# Altium schematic sheet SD_Card.SchDoc: SD Card
size 431 x 279 mm; SheetNumber: 11; SheetTotal: 14; SheetRevision: 1.0
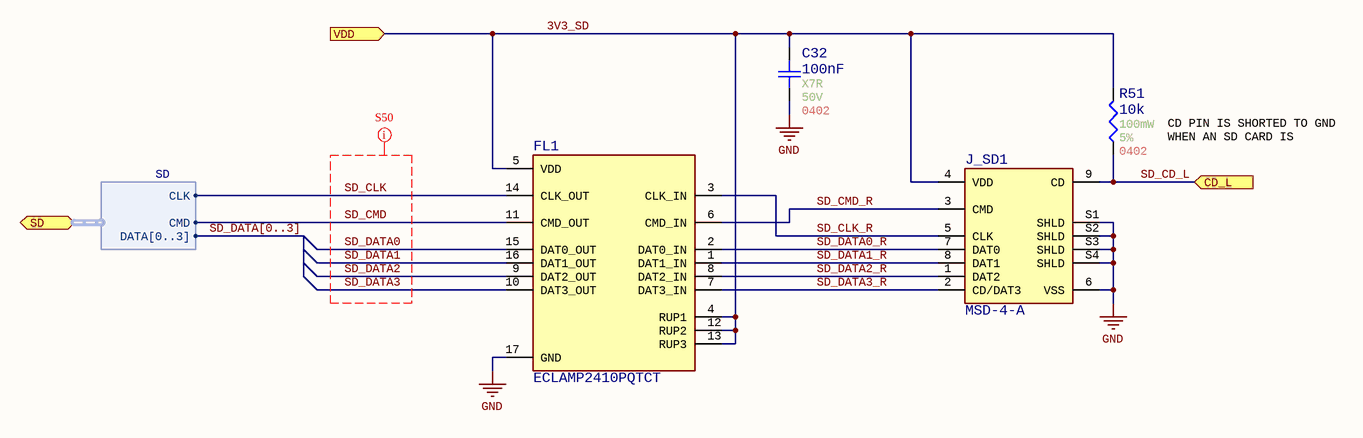
[diagram p0: SD_Card.SchDoc]

## Parts
C32  value 100nF  Temperature Coefficient: X7R  Voltage Rating: 50V  Case/Package: 0402  [Generic 0402 capacitor]  (hidden comment: GRT155R71H104KE01D)
FL1  ECLAMP2410PQTCT  [ECLAMP2410PQTCT]
J_SD1  MSD-4-A  [MSD-4-A]
R51  value 10k  Power: 100mW  Tolerance: 5%  Case/Package: 0402  [Generic 0402 Resistor]  (hidden comment: ERJ-2GEJ103X)

## Ports
CD_L (in), SD (bidir, harness SD), VDD (in)

## Harnesses
SD: DATA[0..3], CLK, CMD

## Nets
GND: C32.1 FL1.17(GND) J_SD1.6(VSS) J_SD1.S1(SHLD) J_SD1.S2(SHLD) J_SD1.S3(SHLD) J_SD1.S4(SHLD)
3V3_SD: C32.2 FL1.4(RUP1) FL1.5(VDD) FL1.12(RUP2) FL1.13(RUP3) J_SD1.4(VDD) R51.2 ; port VDD
SD_CD_L: J_SD1.9(CD) R51.1 ; port CD_L
SD_CLK: FL1.14(CLK_OUT) ; port SD.CLK
SD_CLK_R: FL1.3(CLK_IN) J_SD1.5(CLK)
SD_CMD: FL1.11(CMD_OUT) ; port SD.CMD
SD_CMD_R: FL1.6(CMD_IN) J_SD1.3(CMD)
SD_DATA0: FL1.15(DAT0_OUT)
SD_DATA0_R: FL1.2(DAT0_IN) J_SD1.7(DAT0)
SD_DATA1: FL1.16(DAT1_OUT)
SD_DATA1_R: FL1.1(DAT1_IN) J_SD1.8(DAT1)
SD_DATA2: FL1.9(DAT2_OUT)
SD_DATA2_R: FL1.8(DAT2_IN) J_SD1.1(DAT2)
SD_DATA3: FL1.10(DAT3_OUT)
SD_DATA3_R: FL1.7(DAT3_IN) J_SD1.2(CD/DAT3)

## Buses and harness runs
bus SD_DATA[0..3]

## Layout directives
net class S50: SD_CLK, SD_CMD, SD_DATA0, SD_DATA1, SD_DATA2, SD_DATA3

## Notes on the sheet
- CD PIN IS SHORTED TO GND WHEN AN SD CARD IS PRESENT
- Title:
- Author:
- Approved:
- Size:
- Date:
- Git Hash:
- Sch Revision:
- B
- Prj:
- Sheet Revision:
- Variant:
- Edited:
- CONFIDENTIAL
- File:

## Library data of the parts
C32 = CMP-001-00084-12: Ceramic Capacitor, Multilayer, Ceramic, 50V, 10% +Tol, 10% -Tol, X7R, 15% TC, 0.1uF, Surface Mount, 0402; AECQ: Yes; Reach SVHC Compliant: Yes; Mounting Technology: Surface Mount; Termination: Wraparound; Pins: 2; Packaging: Tape and Reel; Package Shape: Rectangular; Multilayer: Yes; Tolerance: 10%; Max Operating Temperature: 125°C; Terminal Finish: Nickel; Capacitor Type: Ceramic; Dielectric Material: Ceramic; Min Operating Temperature: -55°C; RoHS Compliant: Yes
FL1 = CMP-004-00034-1: EMI Filter with Integrated ESD Protection 12pF 40dB 5V Flat Style SMD 16-Pin SLP4016P16 T/R; Polarity: Bidirectional; Min Breakdown Voltage: 6V; ESD Protection: Yes; Max Breakdown Voltage: 10V; Min Operating Temperature: -40°C; REACH SVHC: Yes; Lifecycle Status: Production; RoHS: Compliant; Packaging: Tape & Reel (TR); Reverse Standoff Voltage: 5V; Max Operating Temperature: 125°C; Width: 1.6002mm; China RoHS: Compliant; Height: 660.4µm; Schedule B: 8542390000; Length: 3.9878mm
J_SD1 = CMP-002-00094-1: Micro SD Card Connector, 9 Positions, Connector and Ejector, Push In, Auto Eject Out, Surface Mount, 1.8 mm Height...; Manufacturer: Same Sky; Gender: Female; Max Current Rating: 500mA; Connector Type: SD Card; Manufacturer Series: SD; Case/Package: SD (Micro); Pins: 9
R51 = CMP-009-00185-9: Res Thick Film 0402 10K Ohm 5% 1/10W ±200ppm/°C Molded SMD Punched Carrier T/R; AECQ: No; Pins: 2; Max Operating Temperature: 155°C; RoHS Compliant: Yes; Min Operating Temperature: -55°C; Mounting Technology: Surface Mount